# Altium schematic sheet Main.SchDoc
size A4; SheetNumber: 1; SheetTotal: 8
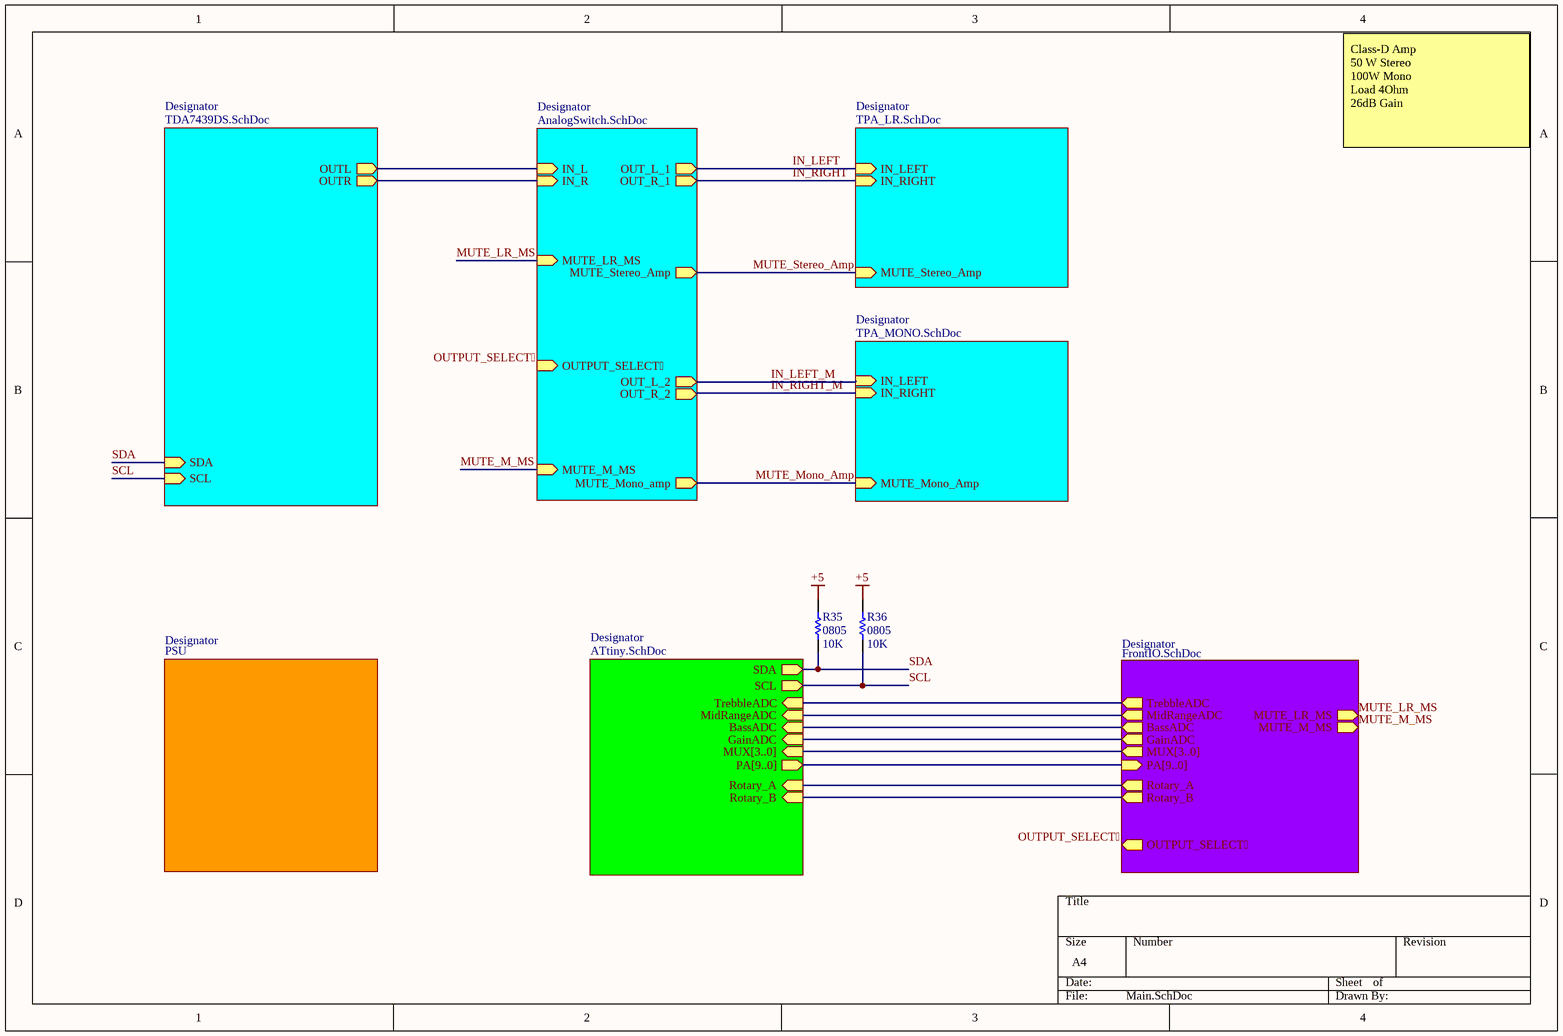
[diagram p0: Main.SchDoc]

## Parts
R35  0805  value 10K  [6-0805_N]
R36  0805  value 10K  [6-0805_N]

## Sub-sheets
Designator = ATtiny.SchDoc: SDA (out), SCL (out), TrebbleADC (in), MidRangeADC (in), BassADC (in), GainADC (in), PA[9..0] (out), Rotary_A (in), Rotary_B (in), MUX[3..0] (in)
Designator = TDA7439DS.SchDoc: SDA (in), SCL (in), OUTL (out), OUTR (out)
Designator = TPA_LR.SchDoc: IN_LEFT (in), IN_RIGHT (in), MUTE_Stereo_Amp (in)
Designator = PSU: no entries
Designator = FrontIO.SchDoc: MidRangeADC (out), TrebbleADC (out), BassADC (out), GainADC (out), Rotary_A (out), Rotary_B (out), PA[9..0] (in), MUX[3..0] (out), MUTE_LR_MS (out), MUTE_M_MS (out), OUTPUT_SELECT (out)
Designator = TPA_MONO.SchDoc: IN_LEFT (in), IN_RIGHT (in), MUTE_Mono_Amp (in)
Designator = AnalogSwitch.SchDoc: IN_L (in), IN_R (in), OUT_L_1 (out), OUT_L_2 (out), OUT_R_1 (out), OUT_R_2 (out), OUTPUT_SELECT (in), MUTE_LR_MS (in), MUTE_M_MS (in), MUTE_Mono_amp (out), MUTE_Stereo_Amp (out)

## Nets
+5: R35.2 R36.2
IN_LEFT: sheet Designator/IN_LEFT, sheet Designator/OUT_L_1
IN_LEFT_M: sheet Designator/IN_LEFT, sheet Designator/OUT_L_2
IN_RIGHT: sheet Designator/IN_RIGHT, sheet Designator/OUT_R_1
IN_RIGHT_M: sheet Designator/IN_RIGHT, sheet Designator/OUT_R_2
MUTE_LR_MS: sheet Designator/MUTE_LR_MS, sheet Designator/MUTE_LR_MS
MUTE_M_MS: sheet Designator/MUTE_M_MS, sheet Designator/MUTE_M_MS
MUTE_Mono_Amp: sheet Designator/MUTE_Mono_Amp, sheet Designator/MUTE_Mono_amp
MUTE_Stereo_Amp: sheet Designator/MUTE_Stereo_Amp, sheet Designator/MUTE_Stereo_Amp
OUTPUT_SELECT: sheet Designator/OUTPUT_SELECT, sheet Designator/OUTPUT_SELECT
SCL: R36.1 ; sheet Designator/SCL, sheet Designator/SCL
SDA: R35.1 ; sheet Designator/SDA, sheet Designator/SDA
(unnamed): sheet Designator/TrebbleADC, sheet Designator/TrebbleADC
(unnamed): sheet Designator/MidRangeADC, sheet Designator/MidRangeADC
(unnamed): sheet Designator/BassADC, sheet Designator/BassADC
(unnamed): sheet Designator/GainADC, sheet Designator/GainADC
(unnamed): sheet Designator/Rotary_A, sheet Designator/Rotary_A
(unnamed): sheet Designator/Rotary_B, sheet Designator/Rotary_B
(unnamed): sheet Designator/OUTL, sheet Designator/IN_L
(unnamed): sheet Designator/OUTR, sheet Designator/IN_R

## Notes on the sheet
- Class-D Amp
  50 W Stereo
  100W Mono
  Load 4Ohm
  26dB Gain

## Library data of the parts
R35 R36 = Res1: Resistor; Published: 8-Jun-2000; LatestRevisionDate: 17-Jul-2002; LatestRevisionNote: Re-released for DXP Platform.; PackageReference: AXIAL-0.3; Publisher: Altium Limited; PackageDescription: Axial Device, Thru-Hole; 2 Leads; 0.3 in Pin Spacing